# Altium schematic sheet HighCurrentDriver.SchDoc
size A4
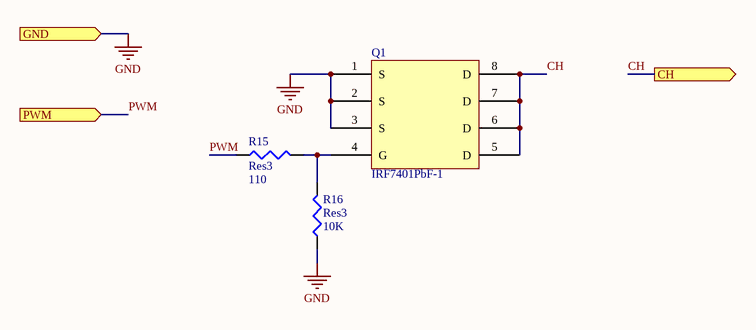
[diagram p0: HighCurrentDriver.SchDoc]

## Parts
Q1  IRF7401PbF-1  [SOIC8]
R15  Res3  value 110  [J1-0603]
R16  Res3  value 10K  [J1-0603]

## Ports
CH (out), GND (in), PWM (in)

## Nets
GND: Q1.1(S) Q1.2(S) Q1.3(S) R16.1 ; port GND
CH: Q1.5(D) Q1.6(D) Q1.7(D) Q1.8(D) ; port CH
PWM: R15.1 ; port PWM
NetQ1_4: Q1.4(G) R15.2 R16.2

## Library data of the parts
Q1 = IRF7401: MOSFET N Channel 20V 8.7A 700mV @ 250uA 22mΩ @ 4.1A,4.5V SOIC-8_150mil RoHS; Manufacturer: Infineon Technologies; Manufacturer Part Number: IRF7401TRPBF; Package: SO-8; Supplier 1: LCSC; Supplier Part Number 1: C169092
R15 = Res3: Resistor; Manufacturer: ROHM Semicon; Manufacturer Part Number: MCR03EZPFX1100; Published: 8-Jun-2000; LatestRevisionDate: 29-May-2009; LatestRevisionNote: IPC-7351 Footprint Added.; PackageReference: J1-0603; Publisher: Altium Limited; PackageDescription: Chip Resistor; Supplier 1: LCSC; Supplier Part Number 1: C308180
R16 = Res3: Resistor; Manufacturer: PANASONIC; Manufacturer Part Number: ERJPA3F1002V; Published: 8-Jun-2000; LatestRevisionDate: 29-May-2009; LatestRevisionNote: IPC-7351 Footprint Added.; PackageReference: J1-0603; Publisher: Altium Limited; PackageDescription: Chip Resistor; Supplier 1: LCSC; Supplier Part Number 1: C441927